# EAGLE design Pandora Driver V3 (EAGLE 5.06)
MFG: Copal; PN: BAT54ATA

## Sheet 1 of 2
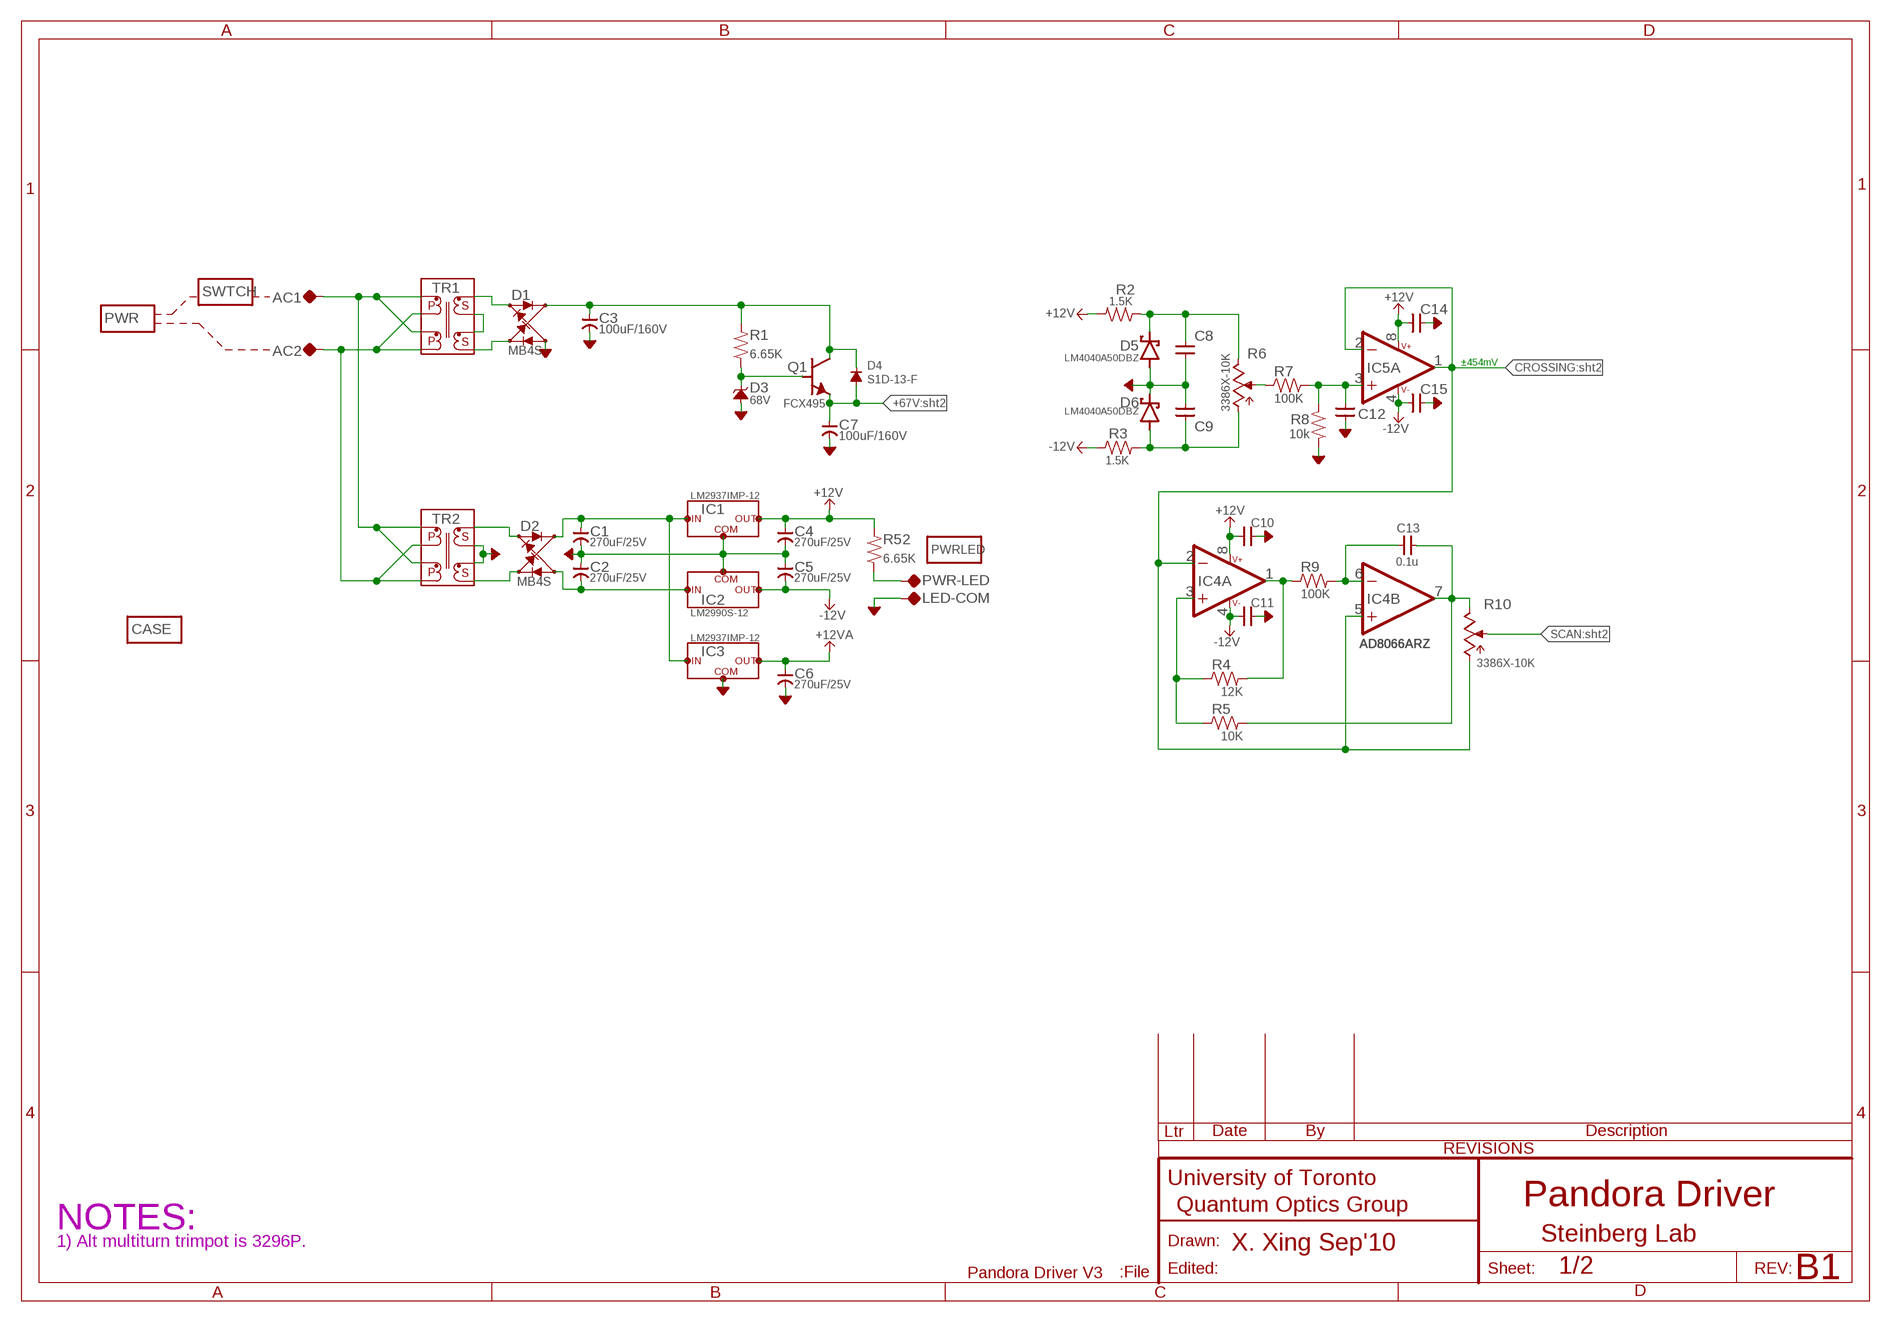
[diagram p0: schematic, sheet 1]

### Parts
AC1  TP-0.125"  [TP-0.125]
AC2  TP-0.125"  [TP-0.125]
C1  270uF/25V  CAP-POL--5MM_C-C  [CAP:5MM-THROUGH]
C2  270uF/25V  CAP-POL--5MM_C-C  [CAP:5MM-THROUGH]
C3  100uF/160V  CAP-POL--NICHICON_UPW_12.5MM  [CAP:NICHICON_UPW-12.5MM]
C4  270uF/25V  CAP-POL--5MM_C-C  [CAP:5MM-THROUGH]
C5  270uF/25V  CAP-POL--5MM_C-C  [CAP:5MM-THROUGH]
C6  270uF/25V  CAP-POL--5MM_C-C  [CAP:5MM-THROUGH]
C7  100uF/160V  CAP-POL--NICHICON_UPW_12.5MM  [CAP:NICHICON_UPW-12.5MM]
C8  0.1uF  CAP-H-0805  [2012(0805)]
C9  0.1uF  CAP-H-0805  [2012(0805)]
C10  0.1u  CAP-H-0805  [2012(0805)]
C11  0.1u  CAP-H-0805  [2012(0805)]
C12  0.1uF  CAP-H-0805  [2012(0805)]
C13  0.1u  CAP-H-0805  [2012(0805)]
C14  0.1uF  CAP-H-0805  [2012(0805)]
C15  0.1uF  CAP-H-0805  [2012(0805)]
CASE  MISC  [MISC]
D1  MB4S  DIODE:BRIDGE-MMC_MB??S  [DIODE:BRIDGE,MMC_MB??S]
D2  MB4S  DIODE:BRIDGE-MMC_MB??S  [DIODE:BRIDGE,MMC_MB??S]
D3  68V  ZENER-SOD323  [SOD323]
D4  S1D-13-F  DIODE,GENERIC-SMA  [EIA-A(SMA)]
D5  LM4040A50DBZ  DIODE,SCHOTTKY-SOT-23  [SOT23]
D6  LM4040A50DBZ  DIODE,SCHOTTKY-SOT-23  [SOT23]
IC1  LM2937IMP-12  REGULATOR:3PIN-SOT223(TAB,2PINS)  [SOT223(C)]
IC2  LM2990S-12  REGULATOR:NEG-3-TERM-TO263  [TO263]
IC3  LM2937IMP-12  REGULATOR:3PIN-SOT223(TAB,2PINS)  [SOT223(C)]
IC4  AD8066ARZ  OPAMP:AD8___(DUAL)-SOIC-8  [SOIC-8]
IC5  AD8066ARZ  OPAMP:AD8___(DUAL)-SOIC-8  [SOIC-8]
LED-COM  TP-0.042B  [TP-0.042B]
PWR  MISC  [MISC]
PWR-LED  TP-0.042B  [TP-0.042B]
PWRLED  MISC  [MISC]
Q1  FCX495  BJT-NPN-SOT89  [SOT89]
R1  6.65K  R-V-0805  [2012(0805)]
R2  1.5K  R-H-0805  [2012(0805)]
R3  1.5K  R-H-0805  [2012(0805)]
R4  12K  R-H-0805  [2012(0805)]
R5  10K  R-H-0805  [2012(0805)]
R6  3386X-10K  POT-BOURNS_3296Y  [BOURNS-3296Y]
R7  100K  R-H-0805  [2012(0805)]
R8  10k  R-H-0805  [2012(0805)]
R9  100K  R-H-0805  [2012(0805)]
R10  3386X-10K  POT-BOURNS_3296Y  [BOURNS-3296Y]
R52  6.65K  R-V-0805  [2012(0805)]
SWTCH  MISC  [MISC]
TR1  TRANSFORMER:2P2S-TAMURA_3FD-3  [TRANSFORMER:TAMURA_3FD-3]
TR2  TRANSFORMER:2P2S-TAMURA_3FD-3  [TRANSFORMER:TAMURA_3FD-3]

### Nets
+12V [power]: C4.+(POS) C10.1 C14.1 IC1.3(OUT) IC4.8(PWR:V++) IC5.8(PWR:V++) R2.2 R52.2 ; also sheet 2
+12VA [power]: C6.+(POS) IC3.3(OUT) ; also sheet 2
+67V [+67V]: C7.+(POS) D4.A Q1.3(E) ; also sheet 2
-12V [power]: C5.-(NEG) C11.1 C15.1 IC2.3(OUT) IC4.4(PWR:V-) IC5.4(PWR:V-) R3.1 ; also sheet 2
AGND: C1.-(NEG) C2.+(POS) C3.-(NEG) C4.-(NEG) C5.+(POS) C6.-(NEG) C7.-(NEG) C8.1 C9.2 C10.2 C11.2 C12.1 C14.2 C15.2 D1.- D3.A D5.1(A) D6.3(C) IC1.2(COM) IC2.1(COM) IC3.2(COM) LED-COM.TP R8.2 TR2.S1B TR2.S2A ; also sheet 2
CROSSING: IC4.2(A:-IN) IC4.5(B:+IN) IC5.1(A:OUT) IC5.2(A:-IN) R10.CCW ; also sheet 2
N$001: C9.1 D6.1(A) R3.2 R6.CCW
N$002: C1.+(POS) D2.+ IC1.1(VI) IC3.1(VI)
N$003: C2.-(NEG) D2.- IC2.2(VI)
N$010 [+67V]: D1.AC2 TR1.S2B
N$011: C12.2 IC5.3(A:+IN) R7.2 R8.1
N$027 [+67V]: D1.AC1 TR1.S1A
N$029 [+67V]: C3.+(POS) D1.+ D4.K(C) Q1.2(C) R1.2
N$035 [AC]: AC2.TP TR1.P1B TR1.P2B TR2.P1B TR2.P2B
N$037: D2.AC1 TR2.S1A
N$038 [+67V]: TR1.S1B TR1.S2A
N$046 [AC]: AC1.TP TR1.P1A TR1.P2A TR2.P1A TR2.P2A
N$047: D2.AC2 TR2.S2B
N$048: R6.W R7.1
N$049: IC4.1(A:OUT) R4.2 R9.1
N$053 [+67V]: D3.C Q1.1(B) R1.1
N$054: C13.1 IC4.6(B:-IN) R9.2
N$059: IC4.3(A:+IN) R4.1 R5.1
N$067: C13.2 IC4.7(B:OUT) R5.2 R10.CW
N$068: PWR-LED.TP R52.1
N$070: C8.2 D5.3(C) R2.1 R6.CW
SCAN: R10.W ; also sheet 2

### Notes on the sheet
- ±454mV
- Pandora Driver
- NOTES:
- Steinberg Lab
- 1) Alt multiturn trimpot is 3296P. | X. Xing Sep'10
- B1

## Sheet 2 of 2
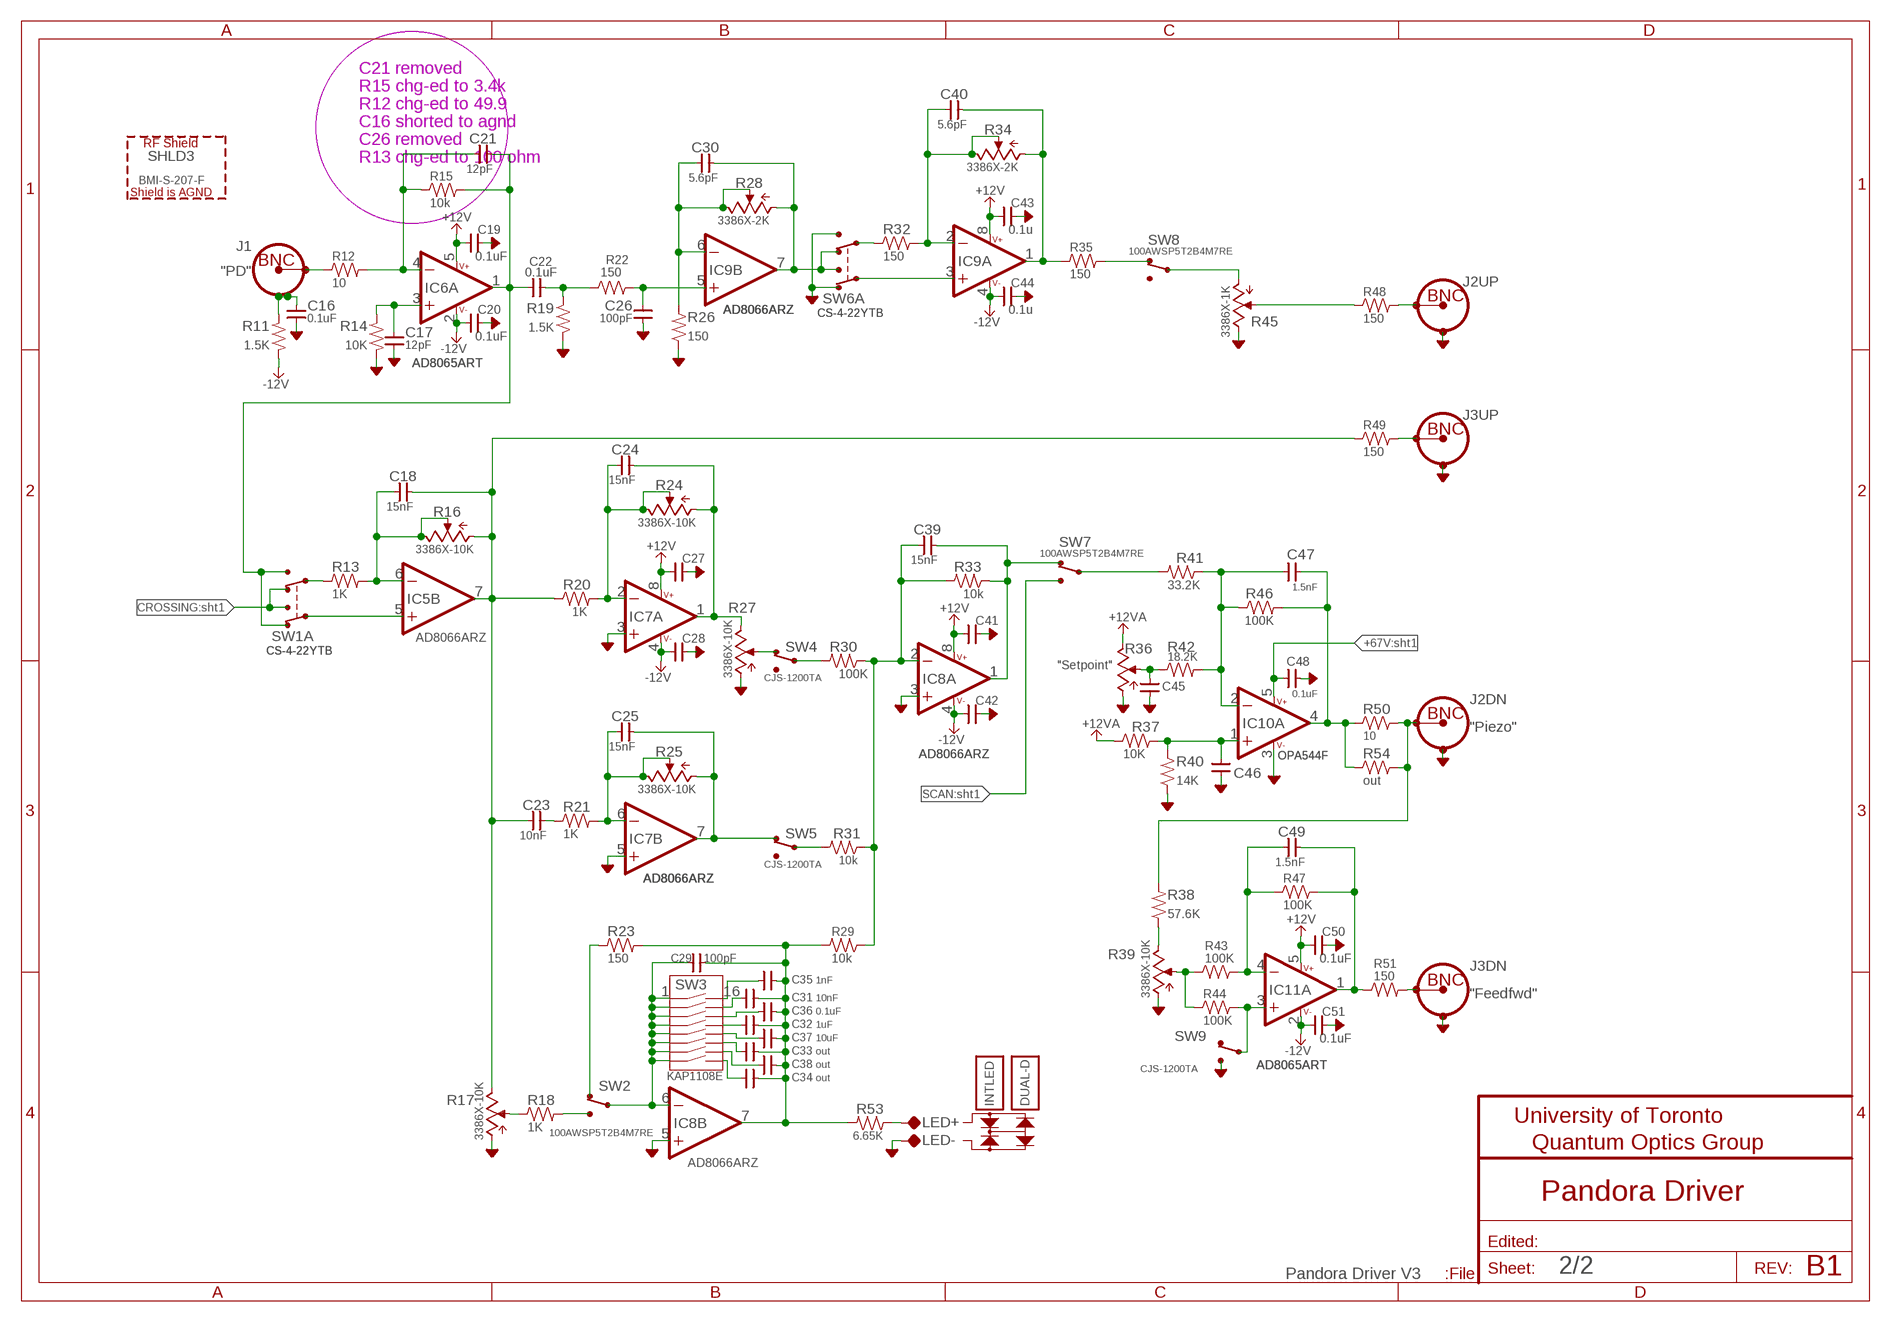
[diagram p1: schematic, sheet 2]

### Parts
C16  0.1uF  CAP-V-0805  [2012(0805)]
C17  12pF  CAP-V-0805  [2012(0805)]
C18  15nF  CAP-H-0805  [2012(0805)]
C19  0.1uF  CAP-H-0805  [2012(0805)]
C20  0.1uF  CAP-H-0805  [2012(0805)]
C21  12pF  CAP-H-0805  [2012(0805)]
C22  0.1uF  CAP-H-0805  [2012(0805)]
C23  10nF  CAP-H-0805  [2012(0805)]
C24  15nF  CAP-H-0805  [2012(0805)]
C25  15nF  CAP-H-0805  [2012(0805)]
C26  100pF  CAP-V-0805  [2012(0805)]
C27  0.1u  CAP-H-0805  [2012(0805)]
C28  0.1u  CAP-H-0805  [2012(0805)]
C29  100pF  CAP-H-0805  [2012(0805)]
C30  5.6pF  CAP-H-0805  [2012(0805)]
C31  10nF  CAP-H-0805  [2012(0805)]
C32  1uF  CAP-H-0805  [2012(0805)]
C33  out  CAP-H-0805  [2012(0805)]
C34  out  CAP-H-0805  [2012(0805)]
C35  1nF  CAP-H-0805  [2012(0805)]
C36  0.1uF  CAP-H-0805  [2012(0805)]
C37  10uF  CAP-H-0805  [2012(0805)]
C38  out  CAP-H-0805  [2012(0805)]
C39  15nF  CAP-H-0805  [2012(0805)]
C40  5.6pF  CAP-H-0805  [2012(0805)]
C41  0.1u  CAP-H-0805  [2012(0805)]
C42  0.1u  CAP-H-0805  [2012(0805)]
C43  0.1u  CAP-H-0805  [2012(0805)]
C44  0.1u  CAP-H-0805  [2012(0805)]
C45  0.1uF  CAP-H-0805  [2012(0805)]
C46  0.1uF  CAP-H-0805  [2012(0805)]
C47  1.5nF  CAP-H-0805  [2012(0805)]
C48  0.1uF  CAP-H-0805  [2012(0805)]
C49  1.5nF  CAP-H-0805  [2012(0805)]
C50  0.1uF  CAP-H-0805  [2012(0805)]
C51  0.1uF  CAP-H-0805  [2012(0805)]
DUAL-D  MISC  [MISC]
IC6  AD8065ART  OPAMP-SOT23-5  [SOT23-5]
IC7  AD8066ARZ  OPAMP:AD8___(DUAL)-SOIC-8  [SOIC-8]
IC8  AD8066ARZ  OPAMP:AD8___(DUAL)-SOIC-8  [SOIC-8]
IC9  AD8066ARZ  OPAMP:AD8___(DUAL)-SOIC-8  [SOIC-8]
IC10  OPA544F  OPAMP:OPA544-TO263(TYPE2)  [TO263-5(TYPE2)]
IC11  AD8065ART  OPAMP-SOT23-5  [SOT23-5]
INTLED  MISC  [MISC]
J1  "PD"  CONN-BNCTYPE3HORIZ  [CONN-BNC-AMP-TYPE3HORIZ]
J2  CONN:BNC,DUAL-BOMAR_364A  [CONN:BNC,DUAL(BOMAR)]
J3  CONN:BNC,DUAL-BOMAR_364A  [CONN:BNC,DUAL(BOMAR)]
LED+  TP-0.042B  [TP-0.042B]
LED-  TP-0.042B  [TP-0.042B]
R11  1.5K  R-V-0805  [2012(0805)]
R12  10  R-H-0805  [2012(0805)]
R13  1K  R-H-0805  [2012(0805)]
R14  10K  R-V-0805  [2012(0805)]
R15  10k  R-H-0805  [2012(0805)]
R16  3386X-10K  POT-BOURNS_3296Y  [BOURNS-3296Y]
R17  3386X-10K  POT-BOURNS_3296Y  [BOURNS-3296Y]
R18  1K  R-H-0805  [2012(0805)]
R19  1.5K  R-V-0805  [2012(0805)]
R20  1K  R-H-0805  [2012(0805)]
R21  1K  R-H-0805  [2012(0805)]
R22  150  R-H-0805  [2012(0805)]
R23  150  R-H-0805  [2012(0805)]
R24  3386X-10K  POT-BOURNS_3296Y  [BOURNS-3296Y]
R25  3386X-10K  POT-BOURNS_3296Y  [BOURNS-3296Y]
R26  150  R-V-0805  [2012(0805)]
R27  3386X-10K  POT-BOURNS_3296Y  [BOURNS-3296Y]
R28  3386X-2K  POT-BOURNS_3296Y  [BOURNS-3296Y]
R29  10k  R-H-0805  [2012(0805)]
R30  100K  R-H-0805  [2012(0805)]
R31  10k  R-H-0805  [2012(0805)]
R32  150  R-H-0805  [2012(0805)]
R33  10k  R-H-0805  [2012(0805)]
R34  3386X-2K  POT-BOURNS_3296Y  [BOURNS-3296Y]
R35  150  R-H-0805  [2012(0805)]
R36  "Setpoint"  POT-3590  [BOURNS_3590]
R37  10K  R-H-0805  [2012(0805)]
R38  57.6K  R-V-0805  [2012(0805)]
R39  3386X-10K  POT-BOURNS_3296Y  [BOURNS-3296Y]
R40  14K  R-V-0805  [2012(0805)]
R41  33.2K  R-H-0805  [2012(0805)]
R42  18.2K  R-H-0805  [2012(0805)]
R43  100K  R-H-0805  [2012(0805)]
R44  100K  R-H-0805  [2012(0805)]
R45  3386X-1K  POT-BOURNS_3296Y  [BOURNS-3296Y]
R46  100K  R-H-0805  [2012(0805)]
R47  100K  R-H-0805  [2012(0805)]
R48  150  R-H-0805  [2012(0805)]
R49  150  R-H-0805  [2012(0805)]
R50  10  R-H-0805  [2012(0805)]
R51  150  R-H-0805  [2012(0805)]
R53  6.65K  R-H-0805  [2012(0805)]
R54  out  R-H-THRU  [PASSIVE_0.4"]
SHLD3  BMI-S-207-F  RF-SHIELD:32-PINS-TO-AGND44X44X9.75MM(BMI-S-207-F)  [RF-SHIELD:44X44X9.75MM(BMI-S-207-F)]
SW1  CS-4-22YTB  SWITCH:DPDT-COPAL_CS4(6PAD)  [SWITCH:DPDT-DIP(COPAL-CS4_6-PAD)]
SW2  100AWSP5T2B4M7RE  SWITCH:SPDT-ESWITCH_1??AV2?  [SWITCH:E-SWITCH_1??AV2?]
SW3  KAP1108E  SWITCH:8PST  [DIL16]
SW4  CJS-1200TA  SWITCH:SPDT_CJS-1200A1  [SWITCH:SPDT-DIP(COPAL)]
SW5  CJS-1200TA  SWITCH:SPDT_CJS-1200A1  [SWITCH:SPDT-DIP(COPAL)]
SW6  CS-4-22YTB  SWITCH:DPDT-COPAL_CS4(6PAD)  [SWITCH:DPDT-DIP(COPAL-CS4_6-PAD)]
SW7  100AWSP5T2B4M7RE  SWITCH:SPDT-ESWITCH_1??AV2?  [SWITCH:E-SWITCH_1??AV2?]
SW8  100AWSP5T2B4M7RE  SWITCH:SPDT-ESWITCH_1??AV2?  [SWITCH:E-SWITCH_1??AV2?]
SW9  CJS-1200TA  SWITCH:SPDT_CJS-1200A1  [SWITCH:SPDT-DIP(COPAL)]

### Nets
+12V [power]: C19.1 C27.1 C41.1 C43.1 C50.1 IC6.5(B:V++) IC7.8(PWR:V++) IC8.8(PWR:V++) IC9.8(PWR:V++) IC11.5(B:V++) ; also sheet 1
+12VA [power]: R36.CW R37.1 ; also sheet 1
+67V [+67V]: C48.1 IC10.5(B:V++) ; also sheet 1
-12V [power]: C20.1 C28.1 C42.1 C44.1 C51.1 IC6.2(B:V-) IC7.4(PWR:V-) IC8.4(PWR:V-) IC9.4(PWR:V-) IC11.2(B:V-) R11.1 ; also sheet 1
AGND: C16.1 C17.1 C19.2 C20.2 C26.1 C27.2 C28.2 C41.2 C42.2 C43.2 C44.2 C45.1 C46.1 C48.2 C50.2 C51.2 IC7.3(A:+IN) IC7.5(B:+IN) IC8.3(A:+IN) IC8.5(B:+IN) IC10.3(B:V-) J2.LWR-COM(DN:SHIELD2) J2.UPR-COM(UP:SHIELD2) J3.LWR-COM(DN:SHIELD2) J3.UPR-COM(UP:SHIELD2) LED-.TP R14.1 R17.CCW R19.1 R26.1 R27.CCW R36.CCW R39.CCW R40.1 R45.CW SW6.2(A:NO\UP\RIGHT) SW6.!1(B:NC\DOWN\LEFT) SW9.1(NO\UP\RIGHT) ; also sheet 1
CROSSING: SW1.1(A:NC\DOWN\LEFT) SW1.!2(B:NO\UP\RIGHT) ; also sheet 1
INPUT_BUF1: C30.2 IC9.7(B:OUT) R28.CCW SW6.1(A:NC\DOWN\LEFT) SW6.!2(B:NO\UP\RIGHT)
INPUT_BUF2: C40.2 IC9.1(A:OUT) R34.CCW R35.1
INPUT_BUF4: C25.2 IC7.7(B:OUT) R25.CCW SW5.2(NC\DOWN\LEFT)
INPUT_BUF5: C24.2 IC7.1(A:OUT) R24.CCW R27.CW
INPUT_BUF6: C39.2 IC8.1(A:OUT) R33.1 SW7.DOWN(NC\DOWN\LEFT)
N$004: C18.1 IC5.6(B:-IN) R13.2 R16.CW R16.W
N$005: R35.2 SW8.DOWN(NC\DOWN\LEFT)
N$006: R30.2 SW4.COM
N$007: R45.CCW SW8.COM
N$008: J3.UPR-CTR(UP:CONDUCTOR) R49.2
N$009: C23.2 R21.1
N$012: R31.2 SW5.COM
N$013: J1.CONDUCTOR R12.1
N$014: C35.1 SW3.16(1B)
N$015: C31.1 SW3.15(2B)
N$016: C47.1 IC10.2(A:-IN) R41.1 R42.2 R46.1
N$017: C16.2 J1.SHIELD1 J1.SHIELD2 R11.2
N$018 [+67V]: C47.2 IC10.4(A:OUT) R46.2 R50.1 R54.1
N$019: C17.2 IC6.3(A:+IN) R14.2
N$020: R13.1 SW1.C(A:COM)
N$021: IC5.5(B:+IN) SW1.!C(B:COM)
N$022: C30.1 IC9.6(B:-IN) R26.2 R28.CW R28.W
N$023: C45.2 R36.W R42.1
N$025: J3.LWR-CTR(DN:CONDUCTOR) R51.2
N$026: R41.2 SW7.COM
N$028: IC9.3(A:+IN) SW6.!C(B:COM)
N$030: C36.1 SW3.14(3B)
N$031: C25.1 IC7.6(B:-IN) R21.2 R25.CW R25.W
N$032: C32.1 SW3.13(4B)
N$033: C40.1 IC9.2(A:-IN) R32.2 R34.CW R34.W
N$034: R32.1 SW6.C(A:COM)
N$036 [+67V]: J2.LWR-CTR(DN:CONDUCTOR) R38.2 R50.2 R54.2
N$039: C33.1 SW3.11(6B)
N$040: C34.1 SW3.9(8B)
N$041: C26.2 IC9.5(B:+IN) R22.2
N$042: R45.W R48.1
N$043: R39.W R43.1 R44.1
N$044: C49.1 IC11.4(A:-IN) R43.2 R47.1
N$045: C49.2 IC11.1(A:OUT) R47.2 R51.1
N$050: C38.1 SW3.10(7B)
N$051: C37.1 SW3.12(5B)
N$052: C29.2 C31.2 C32.2 C33.2 C34.2 C35.2 C36.2 C37.2 C38.2 IC8.7(B:OUT) R23.2 R29.2 R53.2
N$055: IC11.3(A:+IN) R44.2 SW9.COM
N$056: R27.W SW4.2(NC\DOWN\LEFT)
N$057: C22.2 R19.2 R22.1
N$058: R38.1 R39.CW
N$060: C29.1 IC8.6(B:-IN) SW2.COM SW3.1(1A) SW3.2(2A) SW3.3(3A) SW3.4(4A) SW3.5(5A) SW3.6(6A) SW3.7(7A) SW3.8(8A)
N$061: C46.2 IC10.1(A:+IN) R37.2 R40.2
N$062: C24.1 IC7.2(A:-IN) R20.2 R24.CW R24.W
N$063: C39.1 IC8.2(A:-IN) R29.1 R30.1 R31.1 R33.2
N$064: R17.W R18.1
N$065: R18.2 SW2.UP(NO\UP\RIGHT)
N$066: J2.UPR-CTR(UP:CONDUCTOR) R48.2
N$069: R23.1 SW2.DOWN(NC\DOWN\LEFT)
N$071: LED+.TP R53.1
N$091: C21.1 IC6.4(A:-IN) R12.2 R15.1
N$108: C21.2 C22.1 IC6.1(A:OUT) R15.2 SW1.2(A:NO\UP\RIGHT) SW1.!1(B:NC\DOWN\LEFT)
N$123: C18.2 C23.1 IC5.7(B:OUT) R16.CCW R17.CW R20.1 R49.1
SCAN: SW7.UP(NO\UP\RIGHT) ; also sheet 1
Unconnected: SW4.1(NO\UP\RIGHT) SW5.1(NO\UP\RIGHT) SW8.UP(NO\UP\RIGHT) SW9.2(NC\DOWN\LEFT)

### Notes on the sheet
- C21 removed
- R15 chg-ed to 3.4k
- R12 chg-ed to 49.9
- C16 shorted to agnd
- C26 removed
- R13 chg-ed to 100 ohm
- "Piezo"
- "Feedfwd"
- Pandora Driver
- B1

## Power pins joined to a net without a drawn wire
AGND: SHLD3.1(AGND) SHLD3.2(AGND) SHLD3.3(AGND) SHLD3.4(AGND) SHLD3.5(AGND) SHLD3.6(AGND) SHLD3.7(AGND) SHLD3.8(AGND) SHLD3.9(AGND) SHLD3.10(AGND) SHLD3.11(AGND) SHLD3.12(AGND) SHLD3.13(AGND) SHLD3.14(AGND) SHLD3.15(AGND) SHLD3.16(AGND) SHLD3.17(AGND) SHLD3.18(AGND) SHLD3.19(AGND) SHLD3.20(AGND) SHLD3.21(AGND) SHLD3.22(AGND) SHLD3.23(AGND) SHLD3.24(AGND) SHLD3.25(AGND) SHLD3.26(AGND) SHLD3.27(AGND) SHLD3.28(AGND) SHLD3.29(AGND) SHLD3.30(AGND) SHLD3.31(AGND) SHLD3.32(AGND)

## Library data of the parts
AC1 AC2 LED+ LED- LED-COM PWR-LED = QuantumOptics:TP: Testpoint, either SMT pad, small hole or loop style TP such as Keystone 5002K (0.042").
C1-C7 = QuantumOptics:CAP-POL-: Capacitor, Polarized, SMT 0805 and up, probably tantalum.
C8-C15 C18-C25 C27-C51 = QuantumOptics:CAP-H-: Cap, SMT and Through-hole, 0402 and up.
C16 C17 C26 = QuantumOptics:CAP-V-: Cap, SMT and Through-hole, 0402 and up.
CASE DUAL-D INTLED PWR PWRLED SWTCH = QuantumOptics:MISC: Miscellaneous Part, just a placeholder for miscellaeous parts so that they show up on the BOM, e.g. cabinet, external power supply, knobs, etc.
D1 D2 = QuantumOptics:DIODE:BRIDGE: Bridge diode
D3 = QuantumOptics:ZENER: Zener
D4 = QuantumOptics:DIODE,GENERIC: Diode, Generic, plain old vanilla diodes.
D5 D6 = QuantumOptics:DIODE,SCHOTTKY: Schottky Diode, general purpose.
IC1 IC3 = QuantumOptics:REGULATOR:3PIN: LM1086-xxx, National Semiconductor, LDO, adjustable or fixed. http://cache.national.com/ds/LM/LM1086.pdf
IC2 = QuantumOptics:REGULATOR:NEG-3-TERM: Negative 3-Pin, such as LM2990, http://www.national.com/ds/LM/LM2990.pdf
IC4 IC5 IC7-IC9 = QuantumOptics:OPAMP:AD8___(DUAL): AD8xxx, Analog Devices, dual opamp in SOIC-8 and MSOP-8, various versions available. AD8066, AD8656, etc. e.g. http://www.analog.com/UploadedFiles/Data_Sheets/476080131AD8655_6_a.pdf
IC6 IC11 = QuantumOptics:OPAMP: Op Amp, generic, pick the right package. e.g. AD8605: SOT-23-5, RRIO, 10MHz, Ib = 1pA, Vio < 65uV, 2.7-5.5V.
IC10 = QuantumOptics:OPAMP:OPA544: Op Amp, generic, pick the right package. e.g. AD8605: SOT-23-5, RRIO, 10MHz, Ib = 1pA, Vio < 65uV, 2.7-5.5V.
J1 = QuantumOptics:CONN-BNC: BNC PCB, horizontal or vertical, e.g. Horiz: Amp (5)227677-1, nut 1-329631-2, shoulder washer 330620, vert isolated 5227222-6, http://catalog.tycoelectronics.com/TE/bin/TE.Connect?C=1&M=BYPN&TCPN=5227222-6&RQPN=5227222-6 http://catalog.tycoelectronics.com/TE/bin/TE.Connect?C=1&PN=227677-1&M=STARTSWITH&LG=1&I=13&button.x=0&button.y=0 http://catalog.tycoelectronics.com/TE/bin/TE.Connect?C=1&M=BYPN&PID=4946&PN=227673-1&I=13
J2 J3 = QuantumOptics:CONN:BNC,DUAL: Dual BNC, vertical throughhole, Bomar, e.g. 364A2595, H=29.3mm, http://media.digikey.com/pdf/Data%20Sheets/Bomar%20PDFs/BNC_Products_Spec.pdf
Q1 = QuantumOptics:BJT-NPN: NPN BJT, generic, p/n defined by VALUE field. E.g. Fairchild MMBT5551 (abs max 160V, 600mA. hFE>80@10mA.
R1 R11 R14 R19 R26 R38 R40 R52 = QuantumOptics:R-V-*: Resistor, SMT & Through-Hole, vertical symbol
R2-R5 R7-R9 R12 R13 R15 R18 R20-R23 R29-R33 R35 R37 R41-R44 R46-R51 R53 R54 = QuantumOptics:R-H-*: Resistor, SMT & Through-Hole, horizontal symbol
R6 R10 R16 R17 R24 R25 R27 R28 R34 R36 R39 R45 = QuantumOptics:POT: Pot, regular or trimpot
SHLD3 = QuantumOptics:RF-SHIELD:32-PINS-TO-AGND: RF Shield, 44 x 44 x 9.75mm, Laird Tech BMI-S-207-F, SMT, fits QFP160, http://media.digikey.com/pdf/Data%20Sheets/Laird%20Technologies/BMI-S-207.pdf and http://lairdtech.thomasnet.com/item/all-categories/standard-surface-mount-shields-two-piece/bmis-207?plpver=10&categid=100&prodid=3001092&origin=keyword#.; MFG: Larid Tech.
SW1 SW6 = QuantumOptics:SWITCH:DPDT: Switch, DPDT
SW2 SW4 SW5 SW7-SW9 = QuantumOptics:SWITCH:SPDT: Switch, SPDT
SW3 = QuantumOptics:SWITCH:8PST: 8PST DIP Switch, e.g. E-Switch KAP1108E.
TR1 TR2 = QuantumOptics:TRANSFORMER:2P2S: Transformer, dual primary and dual secondary

## Net classes
0 default: width 0.178 mm, drill 0.508 mm, clearance 0.178 mm
1 power: width 0.483 mm, drill 0.711 mm
2 AC: width 0.381 mm, drill 0.711 mm, clearance 1.27 mm
3 +67V: width 0.178 mm, drill 0.508 mm, clearance 0.635 mm

## Board
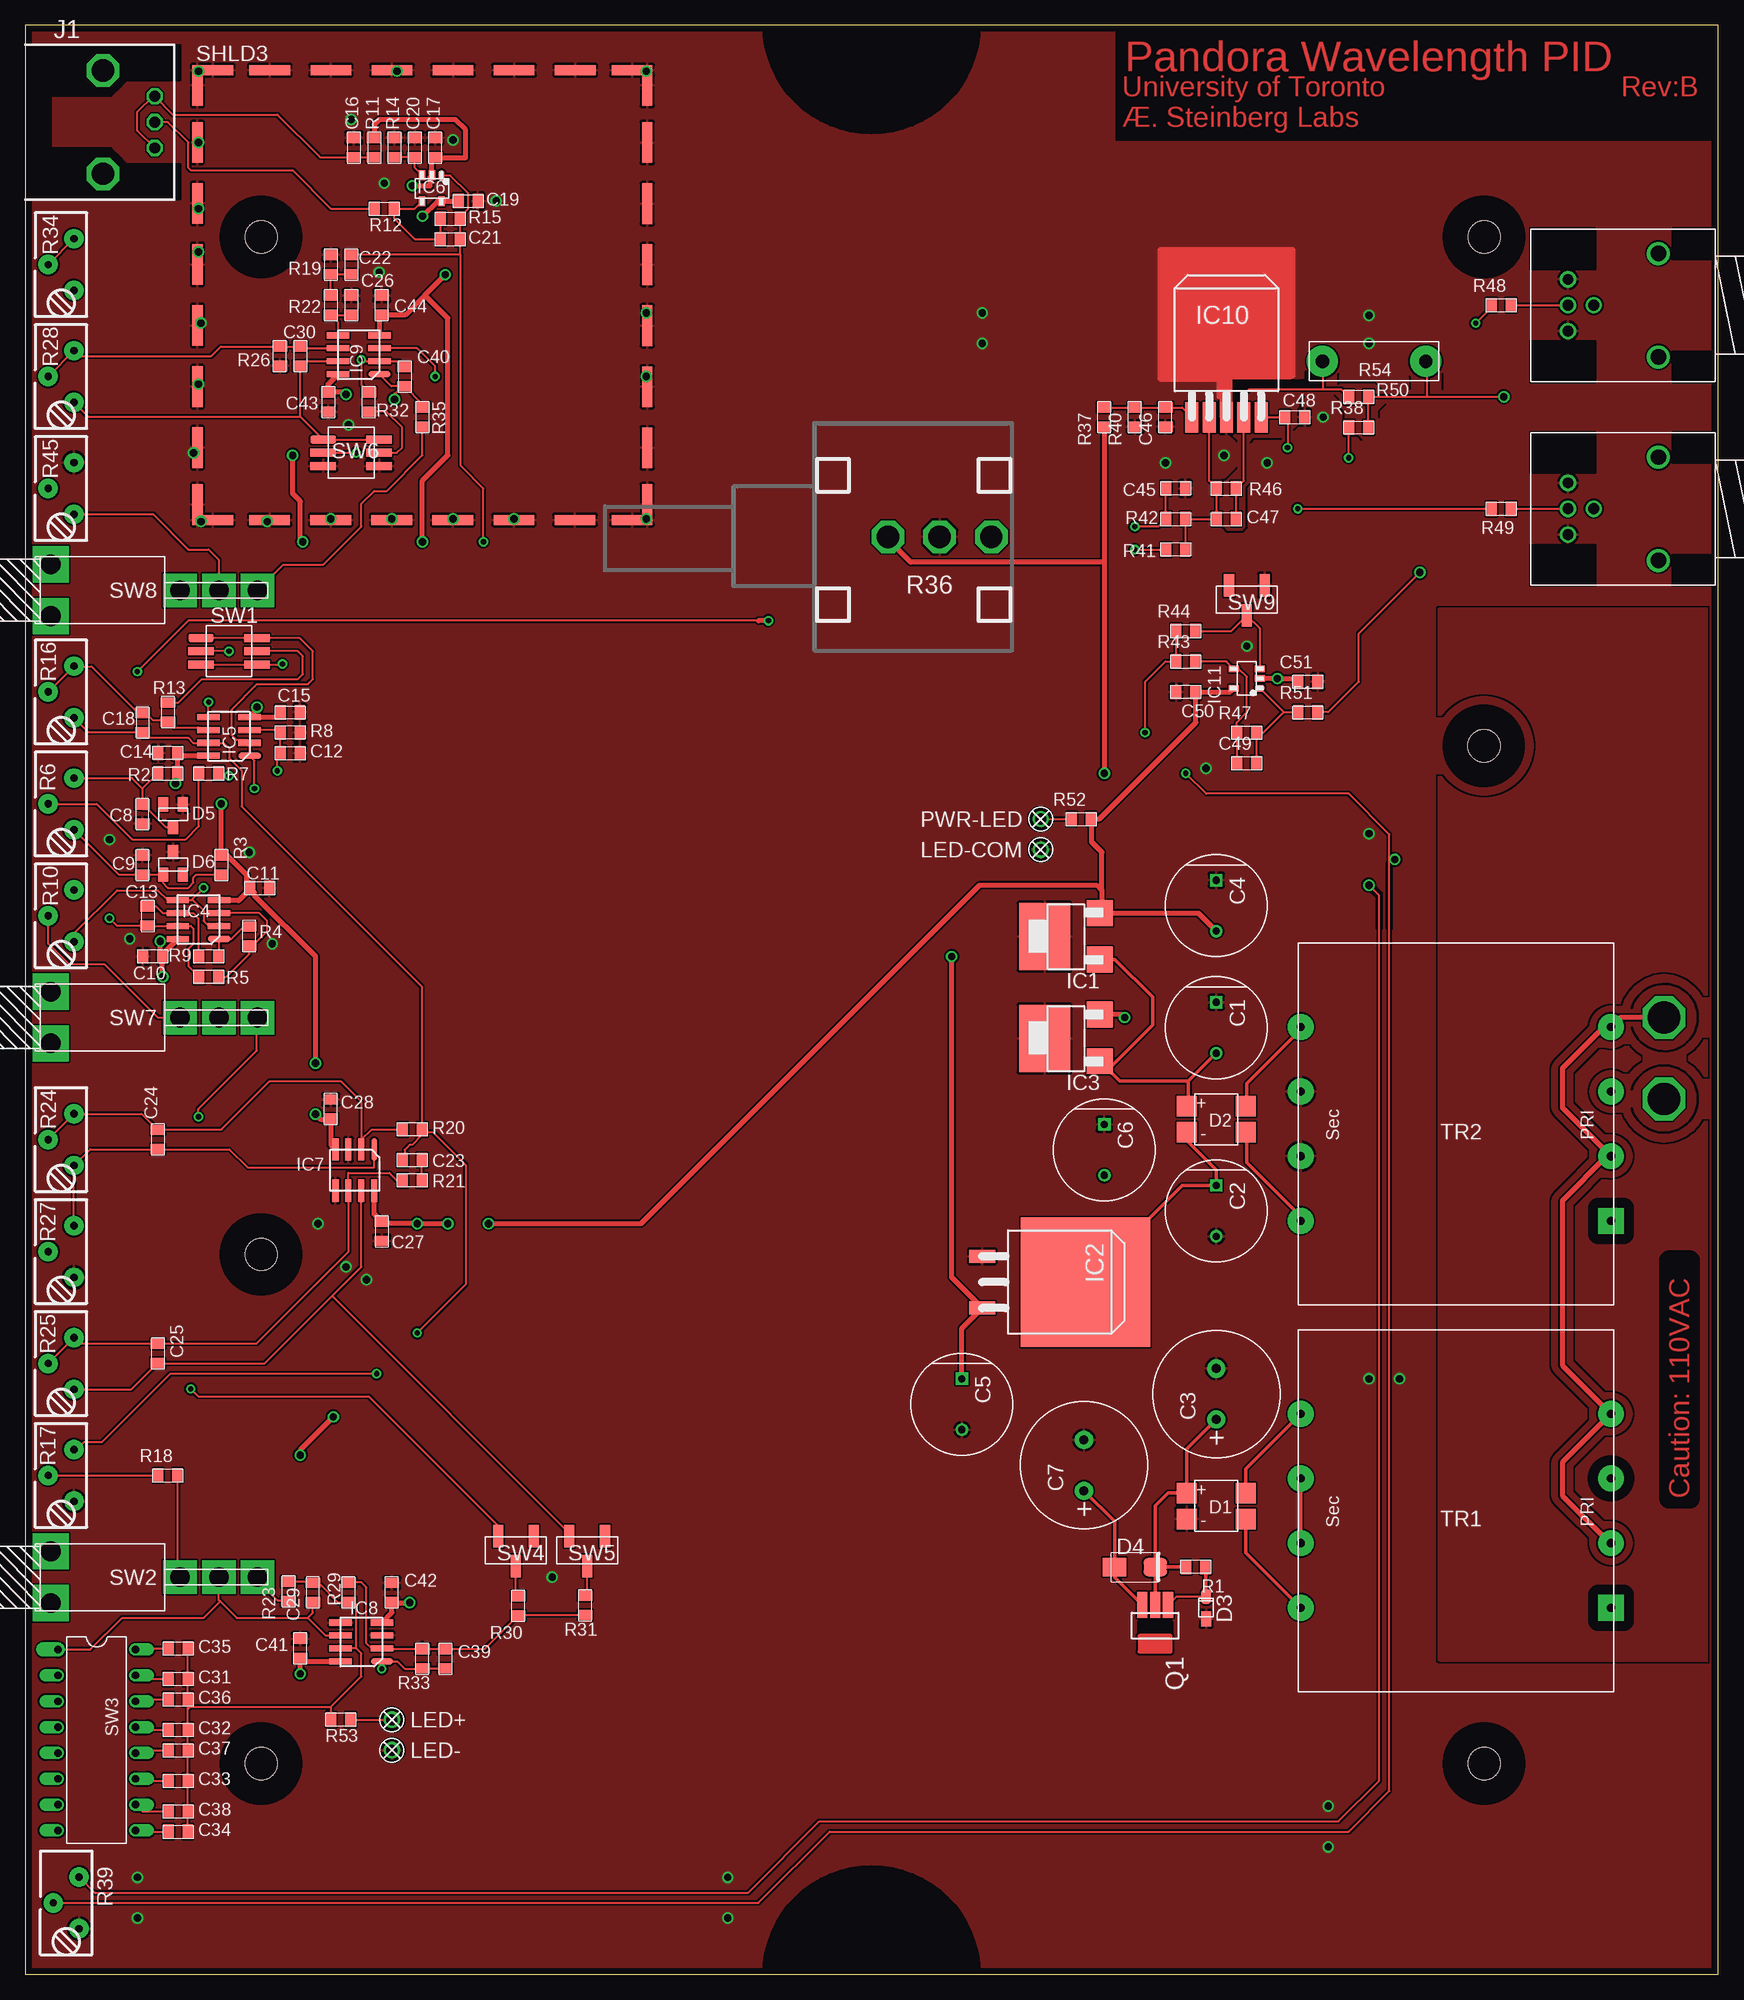
[diagram p2: board, top side]
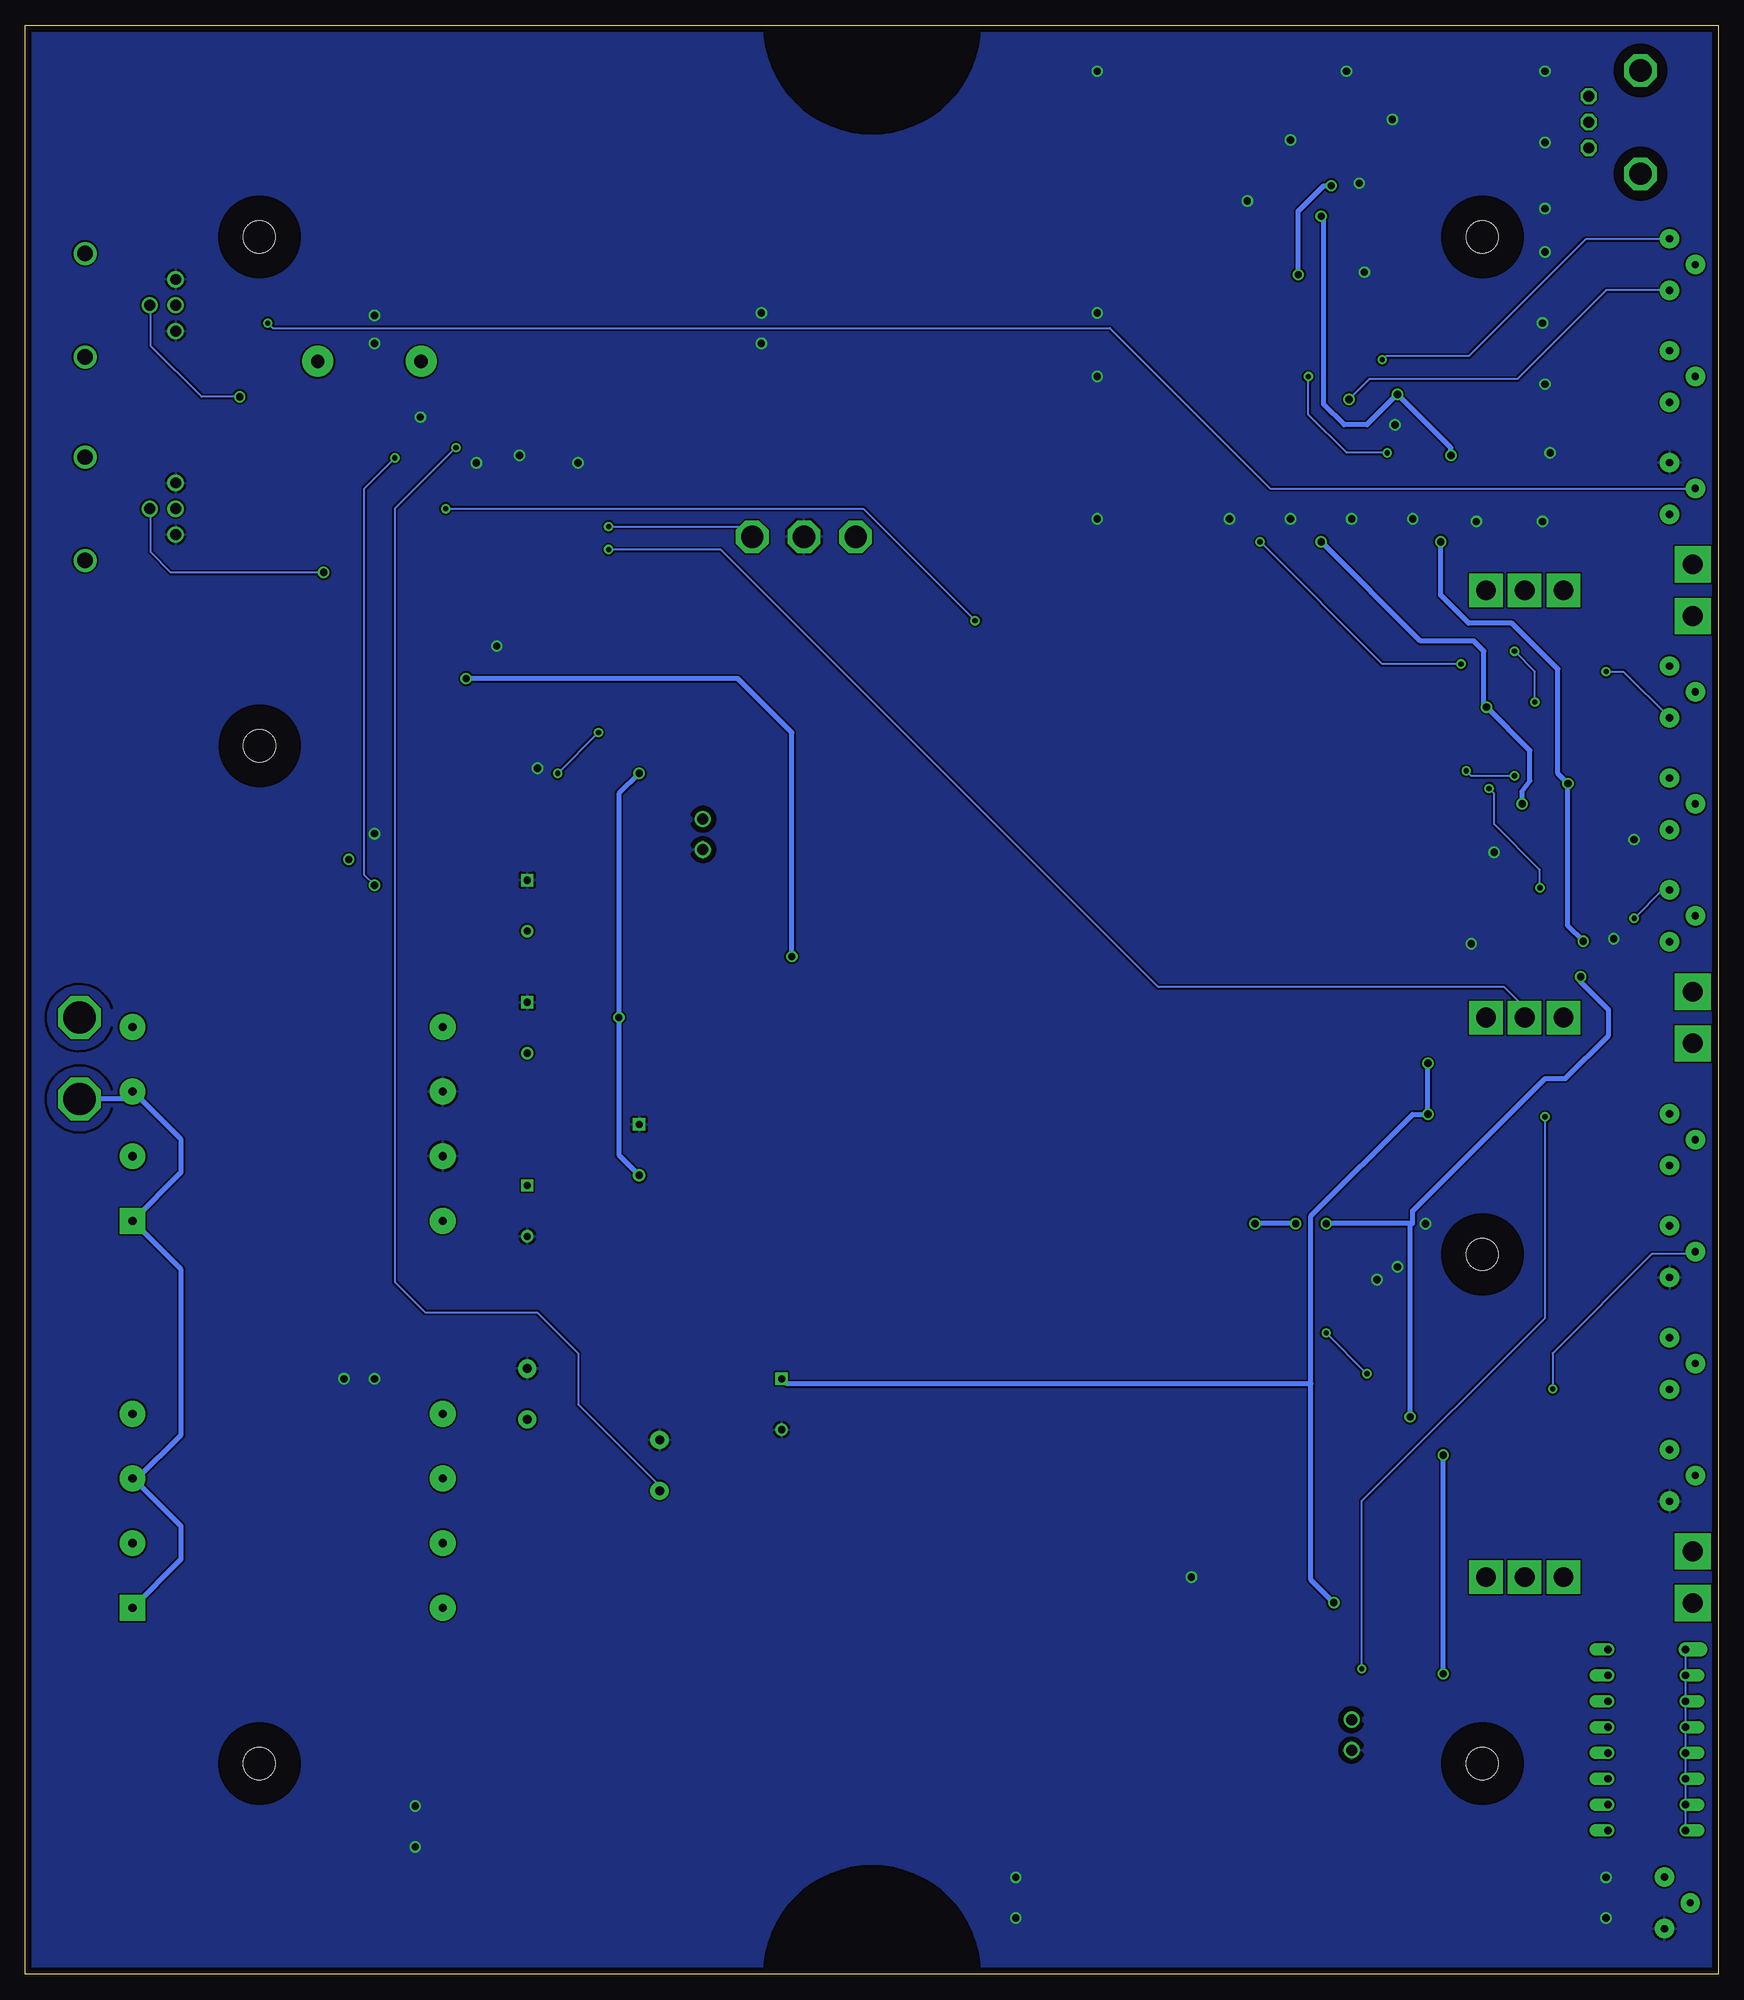
[diagram p3: board, bottom side, seen from below]

Size 166.3 x 191.5 mm. Coordinates in mm from the lower left corner, seen from the top.
Outline: 0,0 166.3,0 166.3,191.5 0,191.5 0,0
Copper layers (1+16): Top 0.035mm / dielectric 1.5mm / Bottom 0.035mm
Design rules "DRC standard check": minimum track width 7mil, minimum drill 20mil, track to track 7mil, track to pad 7mil, pad to pad 7mil, via to via 7mil, smd to smd 0mil, copper to edge 25mil, drill to drill 8mil, minimum pad ring 10mil, minimum via ring 8mil, stop-mask expansion 4mil, vias tented up to drill 0mil, thermal gap 10mil
Holes 3.17 mm at 23.16,20.7 143.33,170.71 143.31,120.7 143.33,20.7 23.16,70.71 23.17,170.72
tRestrict: area 19.2,16.7 to 27.1,24.7; area 139.4,166.8 to 147.3,174.7; area 139.3,116.7 to 147.2,124.7; area 139.4,16.7 to 147.3,24.7; area 19.2,66.8 to 27.1,74.7; area 19.2,166.8 to 27.1,174.7; 36 lines
bRestrict: area 19.2,16.7 to 27.1,24.7; area 139.4,166.8 to 147.3,174.7; area 139.3,116.7 to 147.2,124.7; area 139.4,16.7 to 147.3,24.7; area 19.2,66.8 to 27.1,74.7; area 19.2,166.8 to 27.1,174.7; 2 lines

### Footprints (pad centres in the part's own frame; a part is rotated, then mirrored left to right if it is on the bottom)
TP-0.125 = drill 3.175 octagon: TP 0,0
CAP:5MM-THROUGH = drill 0.711 round: + 2.5,0 | drill 0.711 square: - -2.5,0
CAP:NICHICON_UPW-12.5MM = drill 0.889 pad 1.778 round: + -2.5,0; - 2.5,0
2012(0805) = smd 1.016 x 1.397: 1 -0.953,0; 2 0.953,0
DIODE:BRIDGE,MMC_MB??S = smd 2 x 2: + 2.9,-1.275; - 2.9,1.275; AC1 -2.9,1.275; AC2 -2.9,-1.275
SOD323 = smd 1.5 x 1: A 1.1,0; C -1.1,0
EIA-A(SMA) = smd 2.3 x 1.8: A -2,0; K 2,0
SOT23 = smd 1 x 1.4: 1 -0.953,-0.953; 2 0.953,-0.953; 3 0,1.27
SOT223(C) = smd 2.54 x 2.54: 1 -2.286,-2.54; 3 2.286,-2.54 | smd 6.6 x 5: 2 -0.05,2.87
TO263 = smd 1.27 x 2.54: 1 -2.54,0; 3 2.54,0 | smd 12.7 x 12.7: 2 0,10.16
SOIC-8 = smd 0.6 x 2.2: 1 -1.27,-2.032; 2 0,-2.032; 3 1.27,-2.032; 4 2.54,-2.032; 5 2.54,2.032; 6 1.27,2.032; 7 0,2.032; 8 -1.27,2.032
SOT23-5 = smd 0.635 x 0.991: 1 -0.635,-1.27; 2 0.318,-1.27; 3 1.27,-1.27; 4 1.27,1.27; 5 -0.635,1.27
TO263-5(TYPE2) = smd 1.27 x 3: 1 -3.404,0; 2 -1.702,0; 3 0,0; 4 1.702,0; 5 3.404,0
CONN-BNC-AMP-TYPE3HORIZ = drill 1.067 octagon: CONDUCTOR 0,-12.7; SHIELD1 -2.54,-12.7; SHIELD2 2.54,-12.7 | drill 2.184 octagon: P$1 -5.08,-7.62; P$2 5.08,-7.62
CONN:BNC,DUAL(BOMAR) = drill 1.067 round: LWR-COM 14.45,-2.54; LWR-CTR 11.91,0; UPR-COM 14.45,2.54; UPR-CTR 14.45,0 | drill 1.511 round: MTG1 5.56,-5.08; MTG2 5.56,5.08
TP-0.042B = drill 1.067 round: TP 0,0
SOT89 = smd 2.54 x 1.016: 1 -1.27,1.27; 2 -1.27,0; 3 -1.27,-1.27
BOURNS-3296Y = drill 0.711 pad 1.905 round: CCW 2.54,1.27; CW -2.54,1.27; W 0,-1.27
BOURNS_3590 = drill 2.184 octagon: CCW -12.065,0; CW -6.985,0; W -17.145,0
PASSIVE_0.4" = drill 1.321 pad 3.048 round: 1 -5.08,0; 2 5.08,0
RF-SHIELD:44X44X9.75MM(BMI-S-207-F) = smd 4 x 1: 1 -15.01,-22.1; 2 -9.01,-22.1; 3 -3.01,-22.1; 4 2.99,-22.1; 5 8.99,-22.1; 6 14.99,-22.1; 13 15.01,22.1; 14 9.01,22.1; 15 3.01,22.1; 16 -2.99,22.1; 17 -8.99,22.1; 18 -14.99,22.1; 25 -20.6,-22.1; 27 20.6,-22.1; 31 -20.6,22.1; 32 20.6,22.1 | smd 1 x 4: 7 22.1,-15.01; 8 22.1,-9.01; 9 22.1,-3.01; 10 22.1,2.99; 11 22.1,8.99; 12 22.1,14.99; 19 -22.1,15.01; 20 -22.1,9.01; 21 -22.1,3.01; 22 -22.1,-2.99; 23 -22.1,-8.99; 24 -22.1,-14.99; 26 -22.1,-20.6; 28 22.1,-20.6; 29 22.1,20.6; 30 -22.1,20.6
SWITCH:DPDT-DIP(COPAL-CS4_6-PAD) = smd 0.8 x 2.5: 1 -1.3,2.75; 2 1.3,2.75; !1 1.3,-2.75; !2 -1.3,-2.75; !C 0,-2.75; C 0,2.75
SWITCH:E-SWITCH_1??AV2? = drill 1.93 pad 3.302 square: COM 0,0; DOWN -3.81,0; UP 3.81,0 | drill 1.93 pad 3.556 square: MTG1 16.51,-2.54; MTG2 16.51,2.54
DIL16 = drill 0.711 pad 1.422 offset: 1 -8.89,-3.81 | drill 0.711 offset: 2 -6.35,-3.81; 3 -3.81,-3.81; 4 -1.27,-3.81; 5 1.27,-3.81; 6 3.81,-3.81; 7 6.35,-3.81; 8 8.89,-3.81; 9 8.89,3.81; 10 6.35,3.81; 11 3.81,3.81; 12 1.27,3.81; 13 -1.27,3.81; 14 -3.81,3.81; 15 -6.35,3.81; 16 -8.89,3.81
SWITCH:SPDT-DIP(COPAL) = smd 1 x 2.25: 1 -1.75,-1.475; 2 1.75,-1.475; COM 0,1.475
TRANSFORMER:TAMURA_3FD-3 = drill 0.8 pad 2.54 square: P1A -15.24,9.525 | drill 0.8 pad 2.54 round: P1B -15.24,3.175; P2A -15.24,-3.175; P2B -15.24,-9.525; S1A 15.24,9.525; S1B 15.24,3.175; S2A 15.24,-3.175; S2B 15.24,-9.525

### Placement (x,y rotation side)
AC1  161,86 0 top
AC2  161,94 0 top
C1  117,93 270 top
C2  117,75 270 top
C3  117,57 90 top
C4  117,105 270 top
C5  92,56 270 top
C6  106,81 270 top
C7  104,50 90 top
C8  11.5,114 90 top
C9  11.5,109 90 top
C10  12.5,100 180 top
C11  23,106.75 0 top
C12  26,122 180 top
C13  12,104 270 top
C14  14,120 180 top
C15  26,124 0 top
C16  32.25,179.5 270 top
C17  38.25,179.5 270 top
C18  11.5,123 270 top
C19  43.5,174.25 0 top
C20  40.25,179.5 90 top
C21  41.75,170.5 0 top
C22  32,168 270 top
C23  38,80 0 top
C24  13,82 270 top
C25  13,61 270 top
C26  32,164 270 top
C27  35,73 270 top
C28  30,85 90 top
C29  28.25,37.5 90 top
C30  27,159 270 top
C31  15,29 0 top
C32  15,24 0 top
C33  15,19 0 top
C34  15,14 0 top
C35  15,32 0 top
C36  15,27 0 top
C37  15,22 0 top
C38  15,16 0 top
C39  41.25,31 270 top
C40  37.25,157 270 top
C41  27,32 90 top
C42  36,37.5 90 top
C43  29.75,154.5 270 top
C44  35,164 90 top
C45  113,146 180 top
C46  112,153 90 top
C47  118,143 0 top
C48  124.72,153 0 top
C49  120,119 0 top
C50  114,126 180 top
C51  126,127 0 top
CASE  108.5,-7.75 0 top  (outside the outline)
D1  117,46 180 top
D2  117,84 180 top
D3  116,36 270 top
D4  109,40 0 top
D5  14.5,114 180 top
D6  14.5,109 0 top
DUAL-D  112,-7 0 top  (outside the outline)
IC1  103,102 90 top
IC2  94,68 270 top
IC3  103,92 90 top
IC4  17,103 90 top
IC5  20,121 90 top
IC6  40.25,175.5 180 top
IC7  33,79 180 top
IC8  33,32 90 top
IC9  32.75,158.5 90 top
IC10  118,153 0 top
IC11  120,127 90 top
INTLED  105,-7 0 top  (outside the outline)
J1  0,182 90 top
J2  166,164 180 top
J3  166,144 180 top
LED+  36,25 0 top
LED-  36,22 0 top
LED-COM  99.75,110.5 180 top
PWR  102.24,-7.3 0 top  (outside the outline)
PWR-LED  99.75,113.5 180 top
PWRLED  116,-8 0 top  (outside the outline)
Q1  111,35 270 top
R1  115,40 180 top
R2  14,118 0 top
R3  19.25,109 270 top
R4  22,102 90 top
R5  18,98 180 top
R6  3.5,115 270 top
R7  18,118 0 top
R8  26,120 0 top
R9  18,100 180 top
R10  3.5,104 270 top
R11  34.25,179.5 270 top
R12  35.25,173.5 0 top
R13  14,124 270 top
R14  36.25,179.5 270 top
R15  41.75,172.5 0 top
R16  3.5,126 270 top
R17  3.5,49 270 top
R18  14,49 0 top
R19  30,168 270 top
R20  38,83 180 top
R21  38,78 180 top
R22  30,164 270 top
R23  25.85,37.61 90 top
R24  3.5,82 270 top
R25  3.5,60 270 top
R26  25,159 90 top
R27  3.5,71 270 top
R28  3.5,157 270 top
R29  31.73,37.51 270 top
R30  48.43,36.19 90 top
R31  55,36.25 90 top
R32  33.75,154.5 90 top
R33  39,31 90 top
R34  3.5,168 270 top
R35  39,153 270 top
R36  77.75,141.25 180 top
R37  106,153 90 top
R38  131,152 0 top
R39  4,7 270 top
R40  109,153 90 top
R41  113,140 180 top
R42  113,143 0 top
R43  114,129 0 top
R44  114,132 0 top
R45  3.5,146 270 top
R46  118,146 0 top
R47  120,122 0 top
R48  145,164 0 top
R49  145,144 0 top
R50  131,155 0 top
R51  126,124 0 top
R52  103.75,113.5 0 top
R53  31,25 180 top
R54  132.5,158.5 0 top
SHLD3  39,165 0 top
SW1  20,130 270 top
SW2  19,39 180 top
SW3  7,23 270 top
SW4  48.19,41.57 180 top
SW5  55.19,41.57 180 top
SW6  32,149.5 270 top
SW7  19,94 180 top
SW8  19,136 180 top
SW9  120,135 180 top
SWTCH  114.21,-6.49 0 top  (outside the outline)
TR1  140.54,45.53 180 top
TR2  140.54,83.55 180 top
U$27  [CASE:HAMMOND_1598D]  0,0 0 top
U$39  [TITLEBLOCK_PCB]  0,-5 0 top  (outside the outline)

### Tracks (layer width: path | path; a pad name or v marks a point on that pad's centre or on a via)
+12V  (via drill 0.71)
  Top 0.5: IC9.8 29.75,156.26 C43.1 31.3,155.45 v31.5,155.25 | C19.1 42.28,174.23 IC6.5 40.87,174.25 40.5,174.25 v39,172.75 | IC5.8 15.22,119.73 C14.1 R2.2 14.75,117.8 v14.75,117 | C10.1 13.45,100.22 IC4.8 | C10.1 13.45,98.05 v13.5,98 | v13.25,101.5 13.25,100.2 C10.1 | IC7.8 34.27,74.68 C27.1 35.2,73.75 v38.5,73.75 v41.5,73.75 | IC8.8 27.32,30.73 C41.1 v27,29.5 | v27,51 27,51.5 v30.25,54.75 | C4.+ 115.25,104.25 105.75,104.25 IC1.3 105.75,104.5 105.75,106.5 | 105.75,106.5 105.75,110.25 104.75,111.25 104.75,113.5 | 104.75,113.5 R52.2 | v45.5,73.75 60.5,73.75 93.75,107 105.25,107 105.75,106.5 | IC11.5 118.36,126 C50.1 115,125.95 115,123 105.5,113.5 104.75,113.5 | v26.25,149.25 26.25,145.5 27,144.75 27,141 v27.25,140.75
  Bottom 0.5: v31.5,155.25 34.5,152.25 36.75,152.25 38.75,154.25 38.75,172.5 v39,172.75 | v13.5,98 13.5,97.5 10.75,94.75 10.75,92.25 15,88 17,88 30,75 30,73.75 30.25,73.75 | v13.25,101.5 14.75,103 v14.75,117 15.75,118 15.75,128.25 20.25,132.75 24.5,132.75 27.25,135.5 v27.25,140.75 | v31.5,155.25 31.25,155 | v26.25,149.25 26.25,150 v31.5,155.25 | 30.25,73.75 v38.5,73.75 | v27,29.5 v27,51 | v30.25,54.75 30.25,73.75 | v41.5,73.75 v45.5,73.75
+12VA  (via drill 0.71)
  Top 0.5: IC3.3 107.71,94.29 v108,94 | R37.1 106,138.75 | 106,138.75 v106,118 | R36.CW 84.73,141.01 87,138.75 106,138.75
  Bottom 0.5: C6.+ 108,80.5 v108,94 108,116 v106,118
+67V  (via drill 0.51)
  Top 0.18: IC10.5 C48.1 124,152.77 v124,150
  Top 0.35: Q1.3 107,39 D4.A 107,44.5 C7.+
  Bottom 0.18: C7.+ 104,48 112,56 112,61 116,65 127,65 130,68 130,144 v124,150
-12V  (via drill 0.71)
  Top 0.5: R11.1 34.25,181.75 34.75,182.25 42.25,182.25 43.25,181.25 43.25,178.5 40.3,178.5 C20.1 39.93,178.23 IC6.2 39.75,176.59 39.75,175.75 v38,175.75 | IC9.4 34.78,162.83 C44.1 37.3,163.05 39.25,165 | C15.1 24.59,123.54 IC5.4 22.75,124.26 v22.75,124.5 | v19.25,115 R3.1 19.8,109.95 21.75,108 21.75,107.05 C11.1 | IC4.4 19.07,105.5 20.95,105.5 21.75,106.3 C11.1 | IC7.4 30,81.49 C28.1 29.95,84 29,84 v28.5,84.5 | C11.1 22.5,106.3 22.5,106 28.5,100 v28.5,89.5 | 39.25,165 v41.25,167 | 39.25,165 41.5,162.75 41.5,149.25 39,146.75 v39,140.75 | 35,34.57 IC8.4 36,35.51 C42.1 36.05,36.5 v37.75,36.5 | C5.- 92,63.46 IC2.3 91,68.46 v91,100 | C51.1 124.73,127.32 v123,127.32 IC11.2
  Bottom 0.5: v28.5,89.5 v28.5,84.5 30,84.5 40,74.5 40,58 | v41.25,167 41.25,173.25 38.75,175.75 v38,175.75 | 40,58 40,38.75 v37.75,36.5 | C5.- 91.5,58 40,58 | v91,100 91,122 96.32,127.32 v123,127.32 | v19.25,115 19.25,116.25 18.5,117.25 18.5,120.25 v22.75,124.5 23,124.75 23,130 24,131 29.25,131 v39,140.75
AGND  (via drill 0.71)
  Top 0.18: IC10.3 118,155 117.25,155
  Top 0.5: 117.25,155 117.25,156.75 111.5,156.75 111.5,169.5 124.5,169.5 124.5,157
  other vias: 42,180.25 61,157 94,163.25 132,160.25 132,163 94,160.25 61,163.25 61,143 10.25,101.75 24.25,101.25 22,110.25 8.25,111.5 117.75,149.25 127.5,153 48,143 42,143 36,143 30,143 23.75,142.75 17.25,142.75 16.5,149.5 17,156.25 17.25,162.25 17,169.25 17,173.5 17,180 17,187 36.5,187 61,187 11,9.5 11,5.5 69,5.5 69,9.5 128,16.5 128,12.5 135,58.5 132,58.5 116,118.5 120,130.5 122,148.5 112,148.5 32,182.25 35.25,176 34.75,167.25 31.75,152.25 46.25,174.25 28.75,73.75 31.5,69.5 33.5,68.25 51.75,39 132,112.08
  pour Top (rank 2): 0,0 166.25,0 166.25,180 107,180 107,192 0,191.5
  pour Bottom (rank 2): 0,0 166.25,0 166.25,191.5 0,191.5
CROSSING  (via drill 0.51)
  Top 0.18: SW1.!2 SW1.1 26.95,131.3 28.25,130 28.25,127.25 27.75,126.75 22.75,126.75 20.25,124.25 20.25,121.75 20.75,121.25 21.78,121.25 IC5.2 IC5.1 22,119.7 22.05,119.7 22.5,119.25 v22.5,116.5 | 16.46,105.54 IC4.5 13.96,105.54 13,106.5 9,106.5 4.75,102.25 4.75,101.48 R10.CCW | 16.46,105.54 17.5,104.5 17.5,103.5 18,103 IC4.2 | 16.46,105.54 16.46,105.71 v17.5,106.75
  Bottom 0.18: v17.5,106.75 17.5,108.5 22,113 22,116 v22.5,116.5
INPUT_BUF1
  Top 0.18: 27,153.05 C30.2 27.45,158.5 IC9.7 | 27,153.05 SW6.!2 SW6.1 | 27,153.05 6.18,153.05 R28.CCW
INPUT_BUF2  (via drill 0.71)
  Top 0.18: IC9.1 35.97,156.05 C40.2 | v36.25,154.75 36.25,155.3 C40.2 | R35.1 39,154.3 C40.2
  Bottom 0.18: R34.CCW 4.81,165.5 11,165.5 19.75,156.75 34.25,156.75 v36.25,154.75
INPUT_BUF4
  Top 0.18: R25.CCW 10.41,57.46 C25.2 13.05,60 23.5,60 30.12,66.62 | IC7.7 33,69.5 30.12,66.62 | SW5.2 53.44,43.31 30.12,66.62
INPUT_BUF5
  Top 0.18: IC7.1 34.25,81.01 34.25,79.25 21.84,79.25 20.05,81.05 C24.2 6.36,81.05 R24.CCW R27.CW
INPUT_BUF6  (via drill 0.51)
  Top 0.18: C39.2 R33.1 38.95,30 37.25,30 36.52,30.73 IC8.1 35.03,30.03 v35,30 | v17,84.25 17,85 22.75,90.75 22.75,93.94 SW7.DOWN
  Bottom 0.18: v35,30 35,46.5 17,64.5 v17,84.25
N$001
  Top 0.18: R6.CCW 9.18,108.05 C9.1 D6.1 13.5,108 13.5,107.25 14,106.75 16,106.75 16.5,107.25 16.5,107.75 16.8,108.05 R3.2
N$002
  Top 0.35: 114.25,87.75 114.25,85.5 D2.+ | 114.25,87.75 C1.+ | 114.25,87.75 107.5,87.75 106.38,88.88 | 106.38,88.88 IC3.1 | IC1.1 107.04,99.71 110.75,96 110.75,93.25 106.38,88.88
N$003
  Top 0.35: D2.- 114.25,82.5 114.25,81.75 117,79 C2.- 113.66,77.5 IC2.2
N$004
  Top 0.18: IC5.6 17.23,122.27 17,122.5 14.55,122.5 R13.2 13.8,123.25 12.5,123.25 11.8,123.95 C18.1 11.05,123.95 6.5,128.5 4.81,128.5 | 4.81,128.5 R16.CW | 4.81,128.5 4.73,128.5 R16.W
N$005
  Top 0.18: R35.2 39,149.25 35.5,145.75 34.25,145.75 33,144.5 33,142.25 29.25,138.5 25.31,138.5 SW8.DOWN
N$006
  Top 0.18: SW4.COM 48.19,37.38 R30.2
N$007
  Top 0.18: R45.CCW 12.54,143.46 16,140 18,140 19,139 SW8.COM
N$008
  Top 0.18: R49.2 J3.UPR-CTR
N$009
  Top 0.18: R21.1 C23.2
N$010
  Top 0.35: TR1.S2B 119.9,49.66 D1.AC2
N$011  (via drill 0.51)
  Top 0.18: IC5.3 24.78,122.27 C12.2 R8.1 24.75,119.7 v24.75,118.25 | 18.95,117.8 R7.2 19.2,117.75 v20,117.75
  Bottom 0.18: v20,117.75 24.25,117.75 v24.75,118.25
N$012
  Top 0.18: SW5.COM 55.19,37.14 R31.2
N$013
  Top 0.18: J1.CONDUCTOR 14,182 16,180 16,177.5 16.25,177.25 26.25,177.25 30,173.5 R12.1
N$014
  Top 0.18: C35.1 10.92,32 SW3.16
N$015
  Top 0.18: C31.1 11.16,29 SW3.15
N$016
  Top 0.18: IC10.2 116.3,146.75 R46.1 C47.1 R42.2 R41.1
N$017
  Top 0.18: J1.SHIELD1 11,181.16 11,183 12.54,184.54 J1.SHIELD2 14.49,182.75 24.75,182.75 28.95,178.55 C16.2 R11.2
N$018
  Top 0.18: C47.2 R46.2 119.7,146.75 IC10.4 119.7,155.2 120.25,155.75 127.5,155.75 | 127.5,155.75 129.3,155.75 R50.1 | R54.1 127.5,158.42 127.5,155.75
N$019
  Top 0.18: R14.2 C17.2 38.25,177.5 IC6.3
N$020
  Top 0.18: SW1.C 26.75,130 27.25,129.5 27.25,127.75 26.75,127.25 17.3,127.25 15,124.95 R13.1
N$021  (via drill 0.51)
  Top 0.18: IC5.5 17.97,124.97 v18,125 | v20,130 SW1.!C
  Bottom 0.18: v18,125 18,128 v20,130
N$022
  Top 0.18: IC9.6 27.18,159.77 C30.1 R26.2 19.2,159.95 18.25,159 5.31,159 R28.CW R28.W
N$023  (via drill 0.51)
  Top 0.18: C45.2 R42.1 111.3,142.25 v109,142.25
  Bottom 0.18: v109,142.25 95.89,142.25 R36.W
N$024
  pour Top (isolate 1): 166,134 139,134 139,31 166,31
N$025  (via drill 0.71)
  Top 0.18: R51.2 128,124 131,127 131,131.75 v137,137.75
  Bottom 0.18: v137,137.75 152,137.75 154,139.75 154,143.91 J3.LWR-CTR
N$026  (via drill 0.51)
  Top 0.18: v109,140 R41.2
  Bottom 0.18: SW7.COM 19,95 21,97 55,97 98,140 v109,140
N$027
  Top 0.35: TR1.S1A 119.9,41.41 D1.AC1
N$028  (via drill 0.51)
  Top 0.18: IC9.3 38.48,159.77 40.25,158 v40.25,157 | SW6.!C v32.5,149.5
  Bottom 0.18: v40.25,157 40.25,153.25 36.5,149.5 v32.5,149.5
N$029
  Top 0.35: C3.+ 114.1,51.6 D1.+ 112.28,47.27 111,46 D4.K | D4.K R1.2 | Q1.2 D4.K
N$030
  Top 0.18: C36.1 11,27 SW3.14
N$031
  Top 0.18: R21.2 36.5,78 35.75,78.75 31.75,78.75 31.73,78.73 IC7.6 31.75,76.95 31.75,71 22.75,62 13.05,62 C25.1 5.36,61.95 R25.CW R25.W
N$032
  Top 0.18: C32.1 11.08,24 SW3.13
N$033  (via drill 0.51)
  Top 0.18: 33,158.25 33.25,158.5 IC9.2 36.7,158.5 C40.1 | 33,158.25 33,156.2 R32.2 | v33,158.65 33,158.25 | R34.W R34.CW
  Bottom 0.18: R34.CW 4.81,170.5 13,170.5 24.5,159 32.65,159 v33,158.65
N$034
  Top 0.18: R32.1 35.45,153.55 37,152 37,150 36.5,149.5 SW6.C
N$035
  Top 0.5: TR1.P2B 155.84,55 | TR1.P1B 155.65,42.35 151,47 151,50.27 TR1.P2B | TR1.P2B 151,59.84 151,76 155.38,80.38 TR2.P1B 151,85.16 151,89 155.07,93.08 TR2.P2B 156.71,94 AC2.TP
N$036  (via drill 0.71)
  Top 0.18: R38.2 R50.2 137.75,155 | 137.75,155 v145.25,155 | R54.2 137.75,158.33 137.75,155
  Bottom 0.18: v145.25,155 149,155 154,160 154,163.91 J2.LWR-CTR
N$037
  Top 0.35: D2.AC1 120,82.5 120,79.75 125.5,74.25 TR2.S1A
N$038
  Top 0.35: TR1.S1B TR1.S2A
N$039
  Top 0.18: C33.1 11,19 SW3.11
N$040
  Top 0.18: C34.1 10.92,14 SW3.9
N$041
  Top 0.18: C26.2 R22.2 30.72,162.33 IC9.5
N$042  (via drill 0.51)
  Top 0.18: R48.1 144.05,163.8 v142.5,162.25
  Bottom 0.18: R45.W 44,146 59.75,161.75 142,161.75 v142.5,162.25
N$043  (via drill 0.51, 0.71)
  Top 0.18: R44.1 R43.1 112,129 110,127 v110,122 | R39.W 72,7 79,14 130,14 134,18 134,109.5 | 134,109.5 134,112 130,116 116,116 v114,118 | v134.54,109.54 134.42,109.5 134,109.5
  Bottom 0.18: v114,118 v110,122
N$044
  Top 0.18: R43.2 118,129 IC11.4 119.23,128.27 120,127.5 120,124 119,123 119,122.05 R47.1 C49.1
N$045
  Top 0.18: 123.64,124 IC11.1 | 123.64,124 R51.1 | 123.64,124 121.64,122 R47.2 C49.2
N$046
  Bottom 0.5: TR2.P1A 151,69.25 151,53 155.29,48.7 TR1.P2A 155.71,48.7 151,44 151,40.78 TR1.P1A 156,36.01 | TR2.P1A 156.03,74.03 | TR2.P1A 151,78.81 151,82 155.72,86.72 TR2.P2A 156.5,86 AC1.TP
N$047
  Top 0.35: D2.AC2 120,85.5 120,87.5 125.5,93 TR2.S2B
N$048
  Top 0.18: R7.1 17.05,112.8 15.75,111.5 10.5,111.5 7,115 R6.W
N$049
  Top 0.18: R4.2 21.8,102.75 21.25,102.75 20.23,101.73 IC4.1 19.03,100.08 R9.1
N$050
  Top 0.18: C38.1 11.46,16 SW3.10
N$051
  Top 0.18: C37.1 11.08,22 SW3.12
N$052
  Top 0.18: C34.2 C38.2 C33.2 C37.2 C32.2 15.95,26 | 15.95,26 C36.2 C31.2 C35.2 | 32.5,32 IC8.7 | 32.5,32 33,31.5 33,29.25 30,26.25 | 30,26.25 30,25.05 R53.2 | 30,26.25 16.2,26.25 15.95,26 | 32.5,32 32.5,36.33 32.27,36.56 R29.2 31.67,36.5 30.75,36.5 28.8,38.45 C29.2 28.14,38.56 R23.2
N$053
  Top 0.18: D3.C 113.1,37.1 Q1.1
  Top 0.35: D3.C 115.95,37.15 R1.1
N$054
  Top 0.18: C13.1 12.8,104.95 13.5,104.25 14.95,104.25 IC4.6 16.48,104.27 17,103.75 17,100.05 R9.2
N$055
  Top 0.18: R44.2 118.47,132 SW9.COM 121.27,132.25 IC11.3
N$056  (via drill 0.51)
  Top 0.18: SW4.2 46.44,44.06 33.75,56.75 17,56.75 v16.25,57.5
  Bottom 0.18: v16.25,57.5 16.25,61 6.5,70.75 2.48,70.75 R27.W
N$057
  Top 0.18: C22.2 R19.2 R22.1
N$058  (via drill 0.51, 0.71)
  Top 0.18: v132,107 133,106 133,19 129,15 78,15 71,8 6.81,8 R39.CW | v130,149 130,151.95 R38.1
  Bottom 0.18: v132,107 133,108 133,146 v130,149
N$059
  Top 0.18: R5.1 19.75,98 22,100.25 R4.1 22.2,101.25 22.5,101.25 23.75,102.5 23.75,103.5 22.98,104.27 IC4.3
N$060
  Top 0.18: IC8.6 29.48,33.27 27.75,35 | 27.75,35 20.75,35 19.12,36.62 | 19.12,36.62 19,36.75 SW2.COM | SW3.1 6.39,31.89 9.5,35 17.5,35 19.12,36.62 | C29.1 28.25,35.5 27.75,35
  Bottom 0.18: SW3.1 SW3.2 SW3.3 SW3.4 SW3.5 SW3.6 SW3.7 SW3.8
N$061
  Top 0.18: R37.2 R40.2 C46.2 113.64,153.95 IC10.1
N$062
  Top 0.18: 33,82 IC7.2 | 33,82 34,83 R20.2 | 33,82 33,85.75 31,87.75 24,87.75 19.25,83 13.05,83 C24.1 11.41,84.54 R24.CW R24.W
N$063
  Top 0.18: R33.2 C39.1 45.15,31.95 R30.1 48.49,35.3 R31.1 | R33.2 39,32.5 | R33.2 35.08,31.95 IC8.2 34,32 33.5,32.5 33.5,38 33,38.5 31.77,38.5 R29.1
N$064
  Top 0.18: R17.W R18.1
N$065
  Top 0.18: R18.2 14.95,39.24 SW2.UP
N$066
  Top 0.18: R48.2 J2.UPR-CTR
N$067  (via drill 0.51)
  Top 0.18: R5.2 16,99.05 16,100.75 16.5,101.25 16.5,102.75 16.25,103 IC4.7 12.05,103 C13.2 8.95,103.05 v8.25,103.75
  Bottom 0.18: R10.CW 5.46,106.54 v8.25,103.75
N$068
  Top 0.18: PWR-LED.TP R52.1
N$069
  Top 0.18: SW2.DOWN 22.81,38.69 24.75,36.75 25.76,36.75 R23.1
N$070
  Top 0.18: R2.1 13,118 11.5,116.5 | 11.5,116.5 C8.2 11.45,114.5 12,114.5 13.77,112.73 D5.3 | R6.CW 10.46,117.54 11.5,116.5
N$071
  Top 0.18: R53.1 LED+.TP
N$091
  Top 0.18: R15.1 C21.1 38.25,170.5 36.25,172.5 36.25,173.45 R12.2 38.25,173.5 IC6.4 39,174.21 39,174
N$108  (via drill 0.51)
  Top 0.18: IC6.1 40.91,176.75 41.75,176.75 43.5,175 43.5,173.5 42.55,172.55 42.25,172.55 R15.2 C21.2 42.7,169 42.75,168.95 | 42.75,168.95 C22.1 | SW1.!1 SW1.2 25.2,128.7 v25.25,128.75 | 42.75,168.95 42.75,148.25 45,146 v45,140.75
  Bottom 0.18: v45,140.75 33,128.75 v25.25,128.75
N$123  (via drill 0.51)
  Top 0.18: R16.CCW 6.18,122.05 C18.2 11.55,121.5 16,121.5 16.5,121 IC5.7 19.5,121 20,120.5 20,119.5 21.25,118.25 21.25,114.75 38.95,97.05 R20.1 | v11,128 16,133 72,133 | R20.1 38.95,82.45 38,81.5 37.75,81.5 37.25,81 37.25,80.2 C23.1 | v34.5,59 14.25,59 7.5,52.25 5.75,52.25 5,51.5 R17.CW | v38.5,63 43.25,67.75 43.25,79.5 40,82.75 39,82.75 R20.1 | v125,144 R49.1
  Top 0.5: v73,133 72,133
  Bottom 0.18: v11,128 9.31,128 R16.CCW | v38.5,63 v34.5,59 | v73,133 84,144 v125,144
SCAN
  Top 0.18: R10.W 2.23,101.27 4.25,99.25 7.75,99.25 13,94 SW7.UP

### Text on the board
Top: Pandora Wavelength PID | University of Toronto | Rev:B | Æ. Steinberg Labs | Caution: 110VAC
Document: Pandora Wavelength PID | X.X./A.S. | B | 0.18mm | 0.5mm/0.18sp | 0.18mm | 0.1mm | 0.25mm | Rev-B1: Initial release
Graphics: PD | Current Gain 2 | Up:Current | Dn:Piezo | Current Gain 1 | Current Range | Dn:Feedfwd | Up:Monitor | Current | Piezo Gain | Crossing | Scan | Scan/Run | Piezo P-Gain | Piezo P-Range | Piezo D-Gain | Piezo I-Gain | Piezo Integrator | Feed Forward
Cabinet: AC | Plug